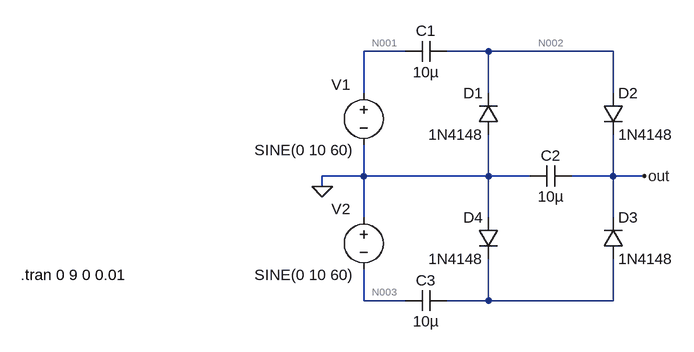
[diagram p0: schematic Draft1.asc]
Draft1.asc, the LTspice schematic file:
Version 4
SHEET 1 964 680
WIRE 144 32 80 32
WIRE 272 32 208 32
WIRE 464 32 272 32
WIRE 80 96 80 32
WIRE 272 96 272 32
WIRE 464 96 464 32
WIRE 80 224 80 176
WIRE 80 224 16 224
WIRE 272 224 272 160
WIRE 272 224 80 224
WIRE 336 224 272 224
WIRE 464 224 464 160
WIRE 464 224 400 224
WIRE 512 224 464 224
WIRE 16 240 16 224
WIRE 80 288 80 224
WIRE 272 288 272 224
WIRE 464 288 464 224
WIRE 80 416 80 368
WIRE 144 416 80 416
WIRE 272 416 272 352
WIRE 272 416 208 416
WIRE 464 416 464 352
WIRE 464 416 272 416
FLAG 16 240 0
FLAG 512 224 out
SYMBOL voltage 80 80 R0
WINDOW 0 -50 3 Left 2
WINDOW 3 -168 104 Left 2
WINDOW 123 0 0 Left 0
WINDOW 39 0 0 Left 0
SYMATTR InstName V1
SYMATTR Value SINE(0 10 60)
SYMBOL cap 208 16 R90
WINDOW 0 0 32 VBottom 2
WINDOW 3 32 32 VTop 2
SYMATTR InstName C1
SYMATTR Value 10µ
SYMBOL diode 448 96 R0
SYMATTR InstName D2
SYMATTR Value 1N4148
SYMBOL diode 288 160 R180
WINDOW 0 24 64 Left 2
WINDOW 3 24 0 Left 2
SYMATTR InstName D1
SYMATTR Value 1N4148
SYMBOL cap 208 432 M270
WINDOW 0 32 32 VTop 2
WINDOW 3 0 32 VBottom 2
SYMATTR InstName C3
SYMATTR Value 10µ
SYMBOL diode 448 352 M180
WINDOW 0 24 64 Left 2
WINDOW 3 24 0 Left 2
SYMATTR InstName D3
SYMATTR Value 1N4148
SYMBOL diode 288 288 M0
SYMATTR InstName D4
SYMATTR Value 1N4148
SYMBOL voltage 80 272 R0
WINDOW 0 -50 3 Left 2
WINDOW 3 -168 104 Left 2
WINDOW 123 0 0 Left 0
WINDOW 39 0 0 Left 0
SYMATTR InstName V2
SYMATTR Value SINE(0 10 60)
SYMBOL cap 400 208 R90
WINDOW 0 0 32 VBottom 2
WINDOW 3 32 32 VTop 2
SYMATTR InstName C2
SYMATTR Value 10µ
TEXT -448 376 Left 2 !.tran 0 9 0 0.01

The netlist it stands for:
* Draft1.asc
V1 N001 0 SINE(0 10 60)
C1 N002 N001 10µ
D2 N002 out 1N4148
D1 0 N002 1N4148
C3 N004 N003 10µ
D3 N004 out 1N4148
D4 0 N004 1N4148
V2 0 N003 SINE(0 10 60)
C2 out 0 10µ
.model D D
.lib standard.dio
.tran 0 9 0 0.01
.backanno
.end

* Results of the author's LTspice run, read from the files saved beside the schematic
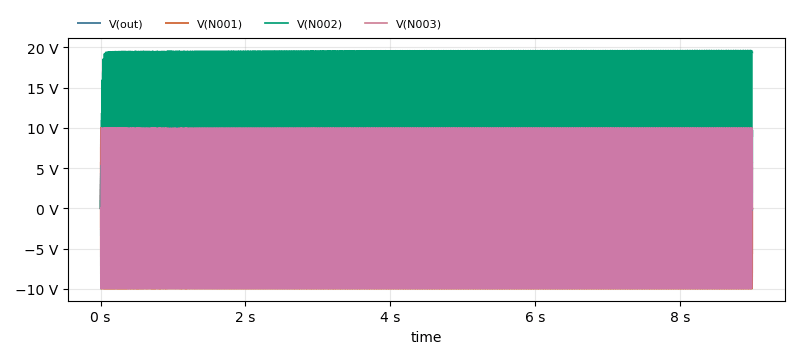
[diagram p1: Transient Analysis of Draft1.asc, plotted from the saved traces]
* Transient Analysis, 1 run:
*   V(out): min 0 V, max 19.37 V, average 19.24 V, rms 19.25 V, last 19.37 V
*   V(N001): min -10 V, max 10 V, average -8.371 mV, rms 7.172 V, last 0 V
*   V(N002): min -769.3 mV, max 19.63 V, average 9.576 V, rms 11.9 V, last 9.669 V
*   V(N003): min -10 V, max 10 V, average 8.371 mV, rms 7.172 V, last 0 V